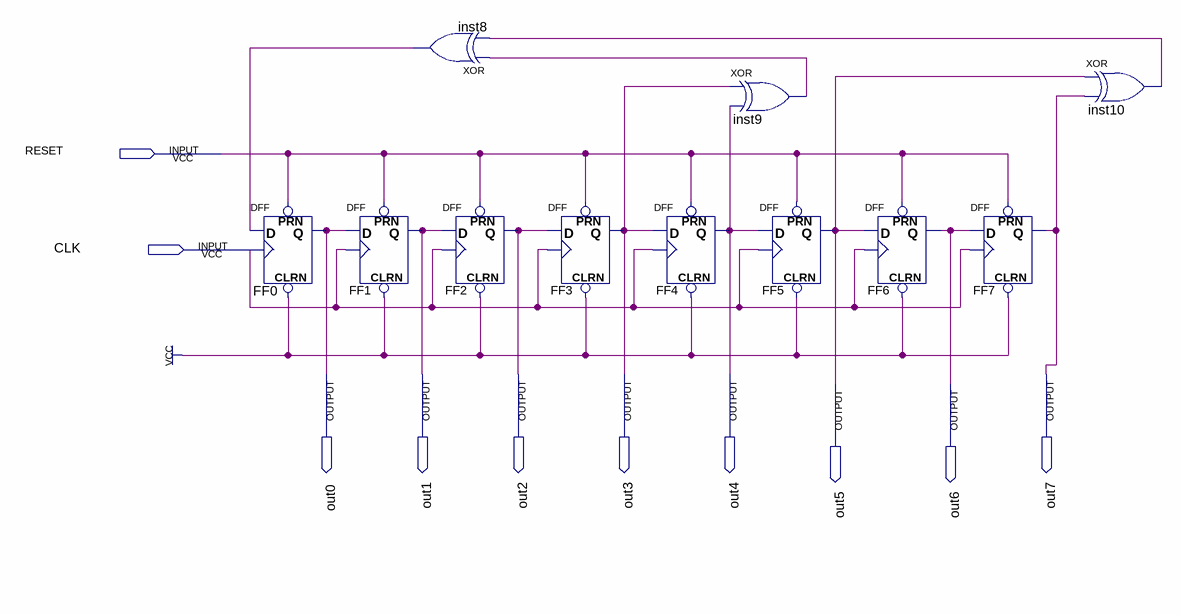
[diagram p0: schematic sheet]
// Quartus schematic lfsr.bdf as structural Verilog: 11 symbols, 10 pins
module lfsr (
  input  RESET,
  input  CLK,
  output out0,
  output out1,
  output out2,
  output out3,
  output out4,
  output out7,
  output out5,
  output out6
);

  wire inst8_out, inst9_out, inst10_out;

  DFF FF0 (.CLRN(1'b1), .CLK(CLK), .D(inst8_out), .PRN(RESET), .Q(out0));
  DFF FF1 (.CLRN(1'b1), .CLK(CLK), .D(out0), .PRN(RESET), .Q(out1));
  xor inst8 (inst8_out, inst9_out, inst10_out);
  DFF FF2 (.CLRN(1'b1), .CLK(CLK), .D(out1), .PRN(RESET), .Q(out2));
  DFF FF3 (.CLRN(1'b1), .CLK(CLK), .D(out2), .PRN(RESET), .Q(out3));
  DFF FF4 (.CLRN(1'b1), .CLK(CLK), .D(out3), .PRN(RESET), .Q(out4));
  xor inst9 (inst9_out, out3, out4);
  DFF FF5 (.CLRN(1'b1), .CLK(CLK), .D(out4), .PRN(RESET), .Q(out5));
  DFF FF6 (.CLRN(1'b1), .CLK(CLK), .D(out5), .PRN(RESET), .Q(out6));
  DFF FF7 (.CLRN(1'b1), .CLK(CLK), .D(out6), .PRN(RESET), .Q(out7));
  xor inst10 (inst10_out, out5, out7);
endmodule
